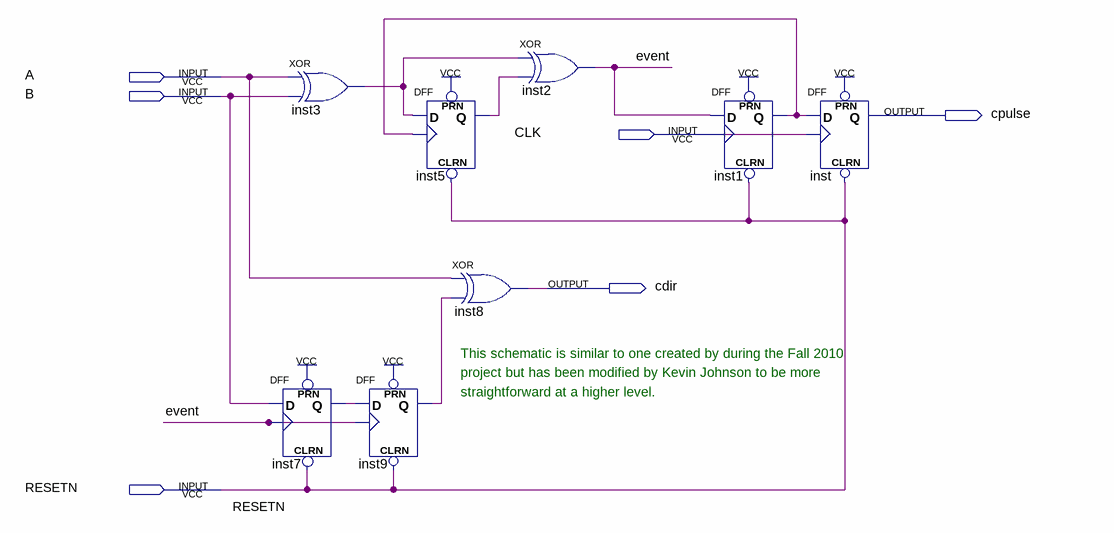
[diagram p0: schematic sheet]
// Quartus schematic QUADRATURE_DECODE.bdf as structural Verilog: 8 symbols, 6 pins
module QUADRATURE_DECODE (
  input  A,
  input  B,
  input  CLK,
  input  RESETN,
  output cpulse,
  output cdir
);

  wire \event , inst1_q, inst3_out, inst5_q, inst7_q, inst9_q;

  DFF inst7 (.CLRN(RESETN), .CLK(\event ), .D(B), .PRN(1'b1), .Q(inst7_q));
  xor inst3 (inst3_out, A, B);
  DFF inst9 (.CLRN(RESETN), .CLK(\event ), .D(inst7_q), .PRN(1'b1), .Q(inst9_q));
  DFF inst5 (.CLRN(RESETN), .CLK(inst1_q), .D(inst3_out), .PRN(1'b1), .Q(inst5_q));
  xor inst8 (cdir, A, inst9_q);
  xor inst2 (\event , inst3_out, inst5_q);
  DFF inst1 (.CLRN(RESETN), .CLK(CLK), .D(\event ), .PRN(1'b1), .Q(inst1_q));
  DFF inst (.CLRN(RESETN), .CLK(CLK), .D(inst1_q), .PRN(1'b1), .Q(cpulse));

  // Notes on the sheet:
  //   This schematic is similar to one created by during the Fall 2010
  //   project but has been modified by Kevin Johnson to be more
  //   straightforward at a higher level.
endmodule
